# EAGLE design lm5175_smps_v0001 (EAGLE 6.4)
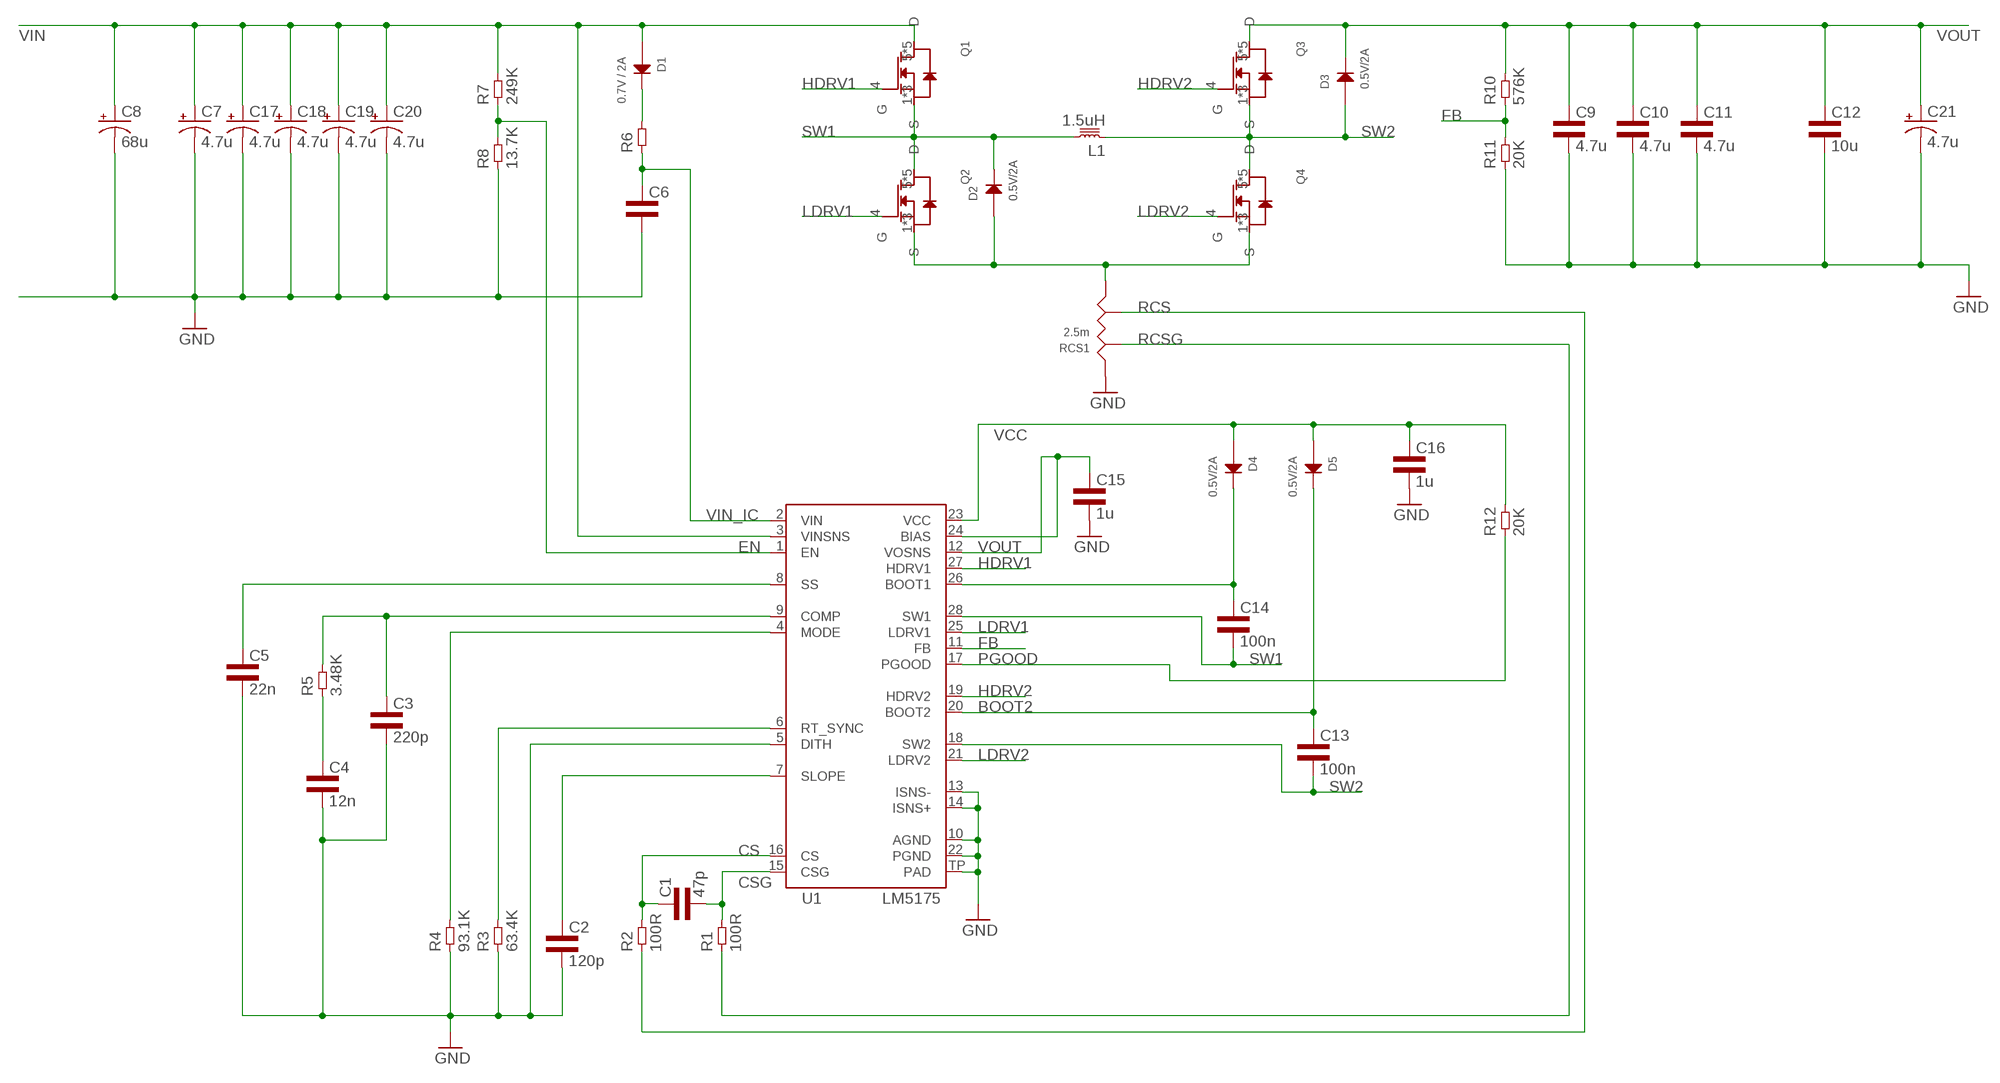
[diagram p0: schematic, sheet 1]

## Parts
C1  47p  CAP0402L3  [0402L3]
C2  120p  CAP0603L3  [0603L3]
C3  220p  CAP0603L3  [0603L3]
C4  12n  CAP0603L3  [0603L3]
C5  22n  CAP0603L3  [0603L3]
C6  CAP0603L3  [0603L3]
C7  4.7u  CPOL-USCT7343  [CT7343]
C8  68u  CPOL-US153CLV-0810  [153CLV-0810]
C9  4.7u  CAP1206L3  [1206L3]
C10  4.7u  CAP1206L3  [1206L3]
C11  4.7u  CAP1206L3  [1206L3]
C12  10u  CAP1206L3  [1206L3]
C13  100n  CAP0603L3  [0603L3]
C14  100n  CAP0603L3  [0603L3]
C15  1u  CAP0603L3  [0603L3]
C16  1u  CAP0603L3  [0603L3]
C17  4.7u  CPOL-USCT7343  [CT7343]
C18  4.7u  CPOL-USCT7343  [CT7343]
C19  4.7u  CPOL-USCT7343  [CT7343]
C20  4.7u  CPOL-USCT7343  [CT7343]
C21  4.7u  CPOL-USSANYO_SMD_E12  [SANYO-OSCON_SMD_E12]
D1  0.7V / 2A  DIODESMA  [SMA-2]
D2  0.5V/2A  DIODESMA  [SMA-2]
D3  0.5V/2A  DIODESMA  [SMA-2]
D4  0.5V/2A  DIODESMA  [SMA-2]
D5  0.5V/2A  DIODESMA  [SMA-2]
L1  1.5uH  INDUCTOR5752  [5.7X5.2]
Q1  CSD18540Q5B  [Q5B]
Q2  CSD18540Q5B  [Q5B]
Q3  CSD18540Q5B  [Q5B]
Q4  CSD18540Q5B  [Q5B]
R1  100R  RES0603L3  [0603L3]
R2  100R  RES0603L3  [0603L3]
R3  63.4K  RES0603L3  [0603L3]
R4  93.1K  RES0603L3  [0603L3]
R5  3.48K  RES0603L3  [0603L3]
R6  RES0603L3  [0603L3]
R7  249K  RES0603L3  [0603L3]
R8  13.7K  RES0603L3  [0603L3]
R10  576K  RES0603L3  [0603L3]
R11  20K  RES0603L3  [0603L3]
R12  20K  RES0603L3  [0603L3]
RCS1  2.5m  CSRES  [R2512]
U1  LM5175  [R-PDSO-G28]

## Nets
BOOT2: C13.P$1 D5.2(CATHODE) U1.20(BOOT2)
CS: C1.P$1 R2.P$2 U1.16(CS)
CSG: C1.P$2 R1.P$2 U1.15(CSG)
EN: R7.P$1 R8.P$2 U1.1(EN)
FB: R10.P$1 R11.P$2 U1.11(FB)
GND: C2.P$2 C3.P$2 C4.P$2 C5.P$2 C6.P$2 C7.- C8.- C9.2 C10.2 C11.2 C12.2 C15.P$2 C16.P$2 C17.- C18.- C19.- C20.- C21.- R3.P$1 R4.P$1 R8.P$1 R11.P$1 RCS1.1_1 RCS1.1_2 U1.5(DITH) U1.10(AGND) U1.13(ISNS-) U1.14(ISNS+) U1.22(PGND) U1.TP(PAD)
HDRV1: Q1.4(G) U1.27(HDRV1)
HDRV2: Q3.4(G) U1.19(HDRV2)
LDRV1: Q2.4(G) U1.25(LDRV1)
LDRV2: Q4.4(G) U1.21(LDRV2)
N$3: C2.P$1 U1.7(SLOPE)
N$5: R3.P$2 U1.6(RT_SYNC)
N$6: R4.P$2 U1.4(MODE)
N$7: C4.P$1 R5.P$1
N$8: C3.P$1 R5.P$2 U1.9(COMP)
N$11: C5.P$1 U1.8(SS)
N$12: D1.2(CATHODE) R6.P$2
N$20: C14.P$1 D4.2(CATHODE) U1.26(BOOT1)
PGOOD: R12.P$1 U1.17(PGOOD)
RCS: R2.P$1 RCS1.CS_2
RCSG: R1.P$1 RCS1.CS_1
SNS_HIGH: D2.1(ANODE) Q2.1(S) Q2.2(S) Q2.3(S) Q4.1(S) Q4.2(S) Q4.3(S) RCS1.2_1 RCS1.2_2
SW1: C14.P$2 D2.2(CATHODE) L1.2 Q1.1(S) Q1.2(S) Q1.3(S) Q2.5(D) Q2.6(D) Q2.7(D) Q2.8(D) Q2.9(D) U1.28(SW1)
SW2: C13.P$2 D3.1(ANODE) L1.1 Q3.1(S) Q3.2(S) Q3.3(S) Q4.5(D) Q4.6(D) Q4.7(D) Q4.8(D) Q4.9(D) U1.18(SW2)
VCC: C16.P$1 D4.1(ANODE) D5.1(ANODE) R12.P$2 U1.23(VCC)
VIN: C7.+ C8.+ C17.+ C18.+ C19.+ C20.+ D1.1(ANODE) Q1.5(D) Q1.6(D) Q1.7(D) Q1.8(D) Q1.9(D) R7.P$2 U1.3(VINSNS)
VIN_IC: C6.P$1 R6.P$1 U1.2(VIN)
VOUT: C9.1 C10.1 C11.1 C12.1 C15.P$1 C21.+ D3.2(CATHODE) Q3.5(D) Q3.6(D) Q3.7(D) Q3.8(D) Q3.9(D) R10.P$2 U1.12(VOSNS) U1.24(BIAS)

## Library data of the parts
C1-C6 C9-C16 = common:CAP
C7 C8 C17-C21 = rcl:CPOL-US: POLARIZED CAPACITOR, American symbol
D1-D5 = common:DIODE
L1 = common:INDUCTOR
Q1-Q4 = common:CSD18540Q5B: N-Channel High-Power MosFET; I_MAX: 221A; PD: 195W; PULSED_DRAIN_CURRENT: 400A; VGS: +/- 20V; V_MAX: 60V
R1-R8 R10-R12 = common:RES
RCS1 = common:CSRES: Current sense resistor with optimized footprint for sense accuracy. Vias should be place at the outer edges of the sense pads with traces connecting them. This provides an error margin of .6% to 2% as long as all other layout guidelines are followed.
U1 = common:LM5175: The LM5175 is a synchronous four-switch buck-boost 1• Single Inductor Buck-Boost Controller for Step- Up/Step-Down DC/DC Conversion DC/DC controller capable of regulating the output voltage at, above, or below the input voltage.

## Board
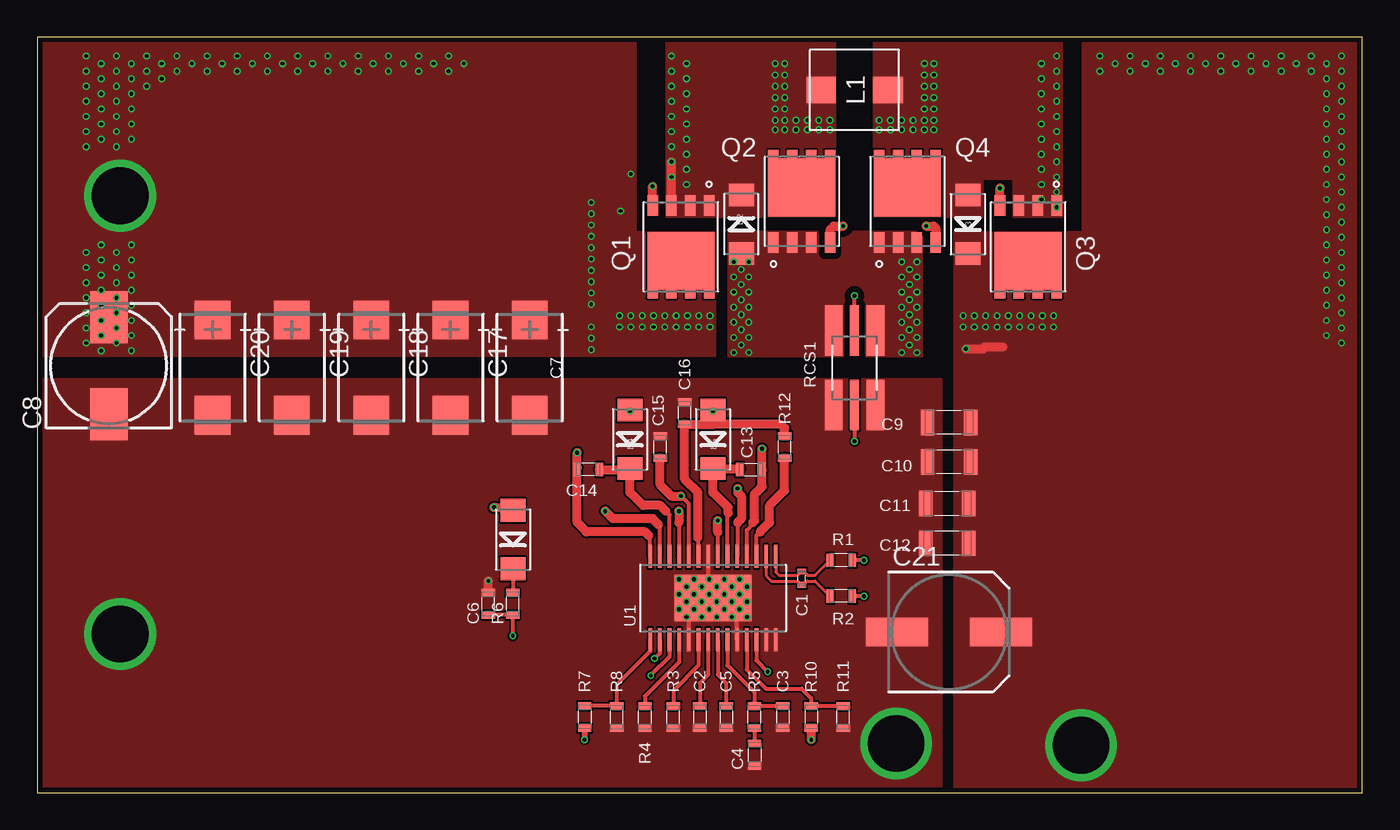
[diagram p1: board, top side]
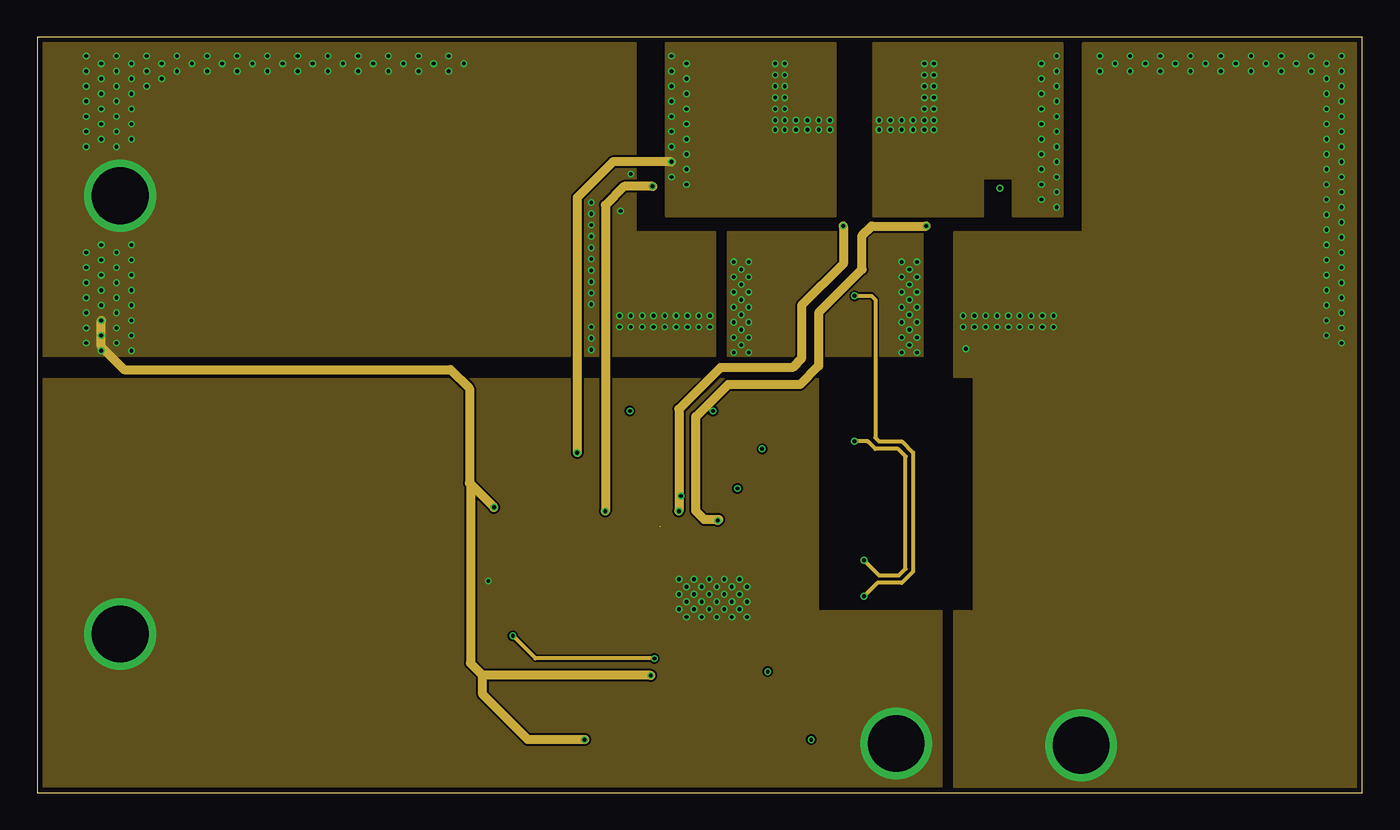
[diagram p2: board, inner layer Route2]
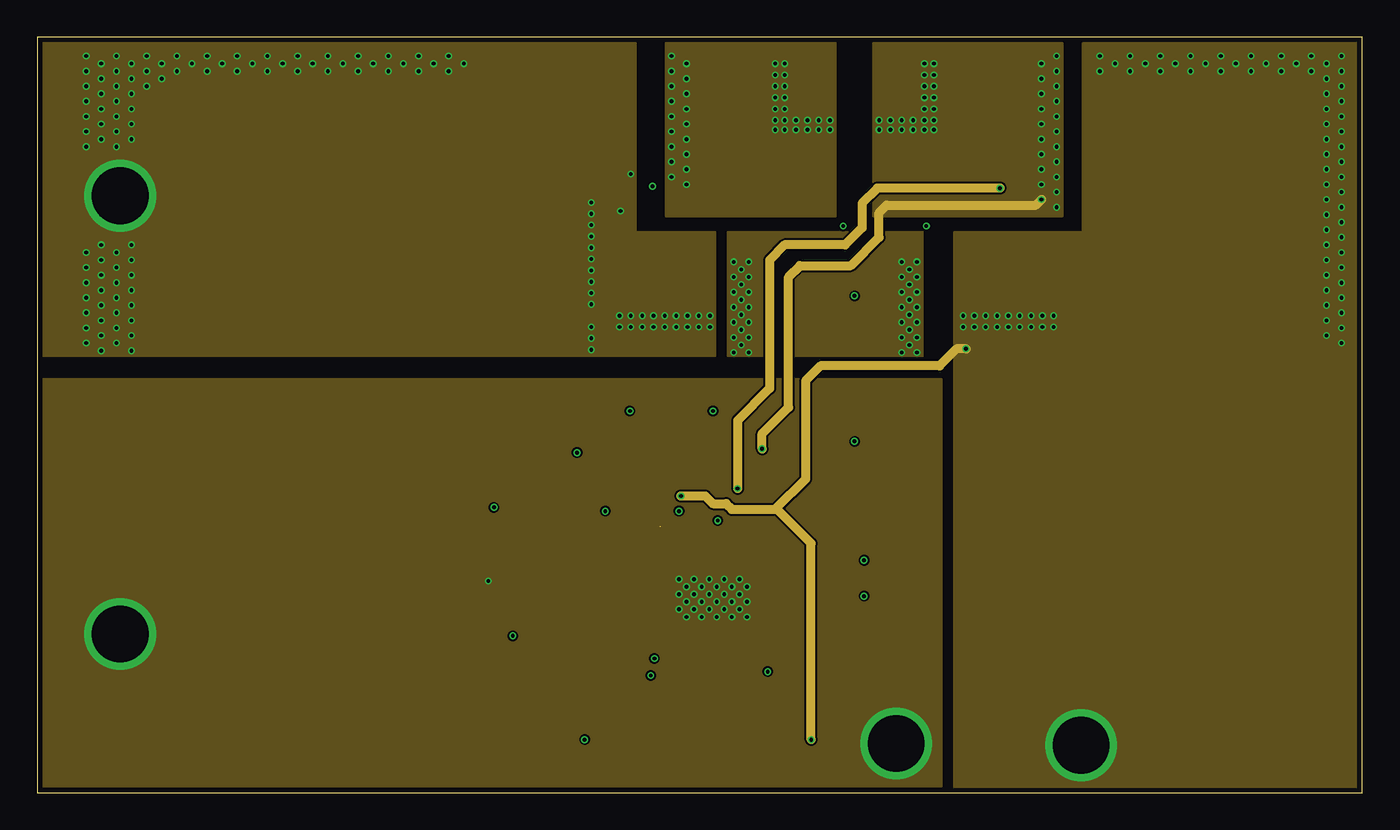
[diagram p3: board, inner layer Route3]
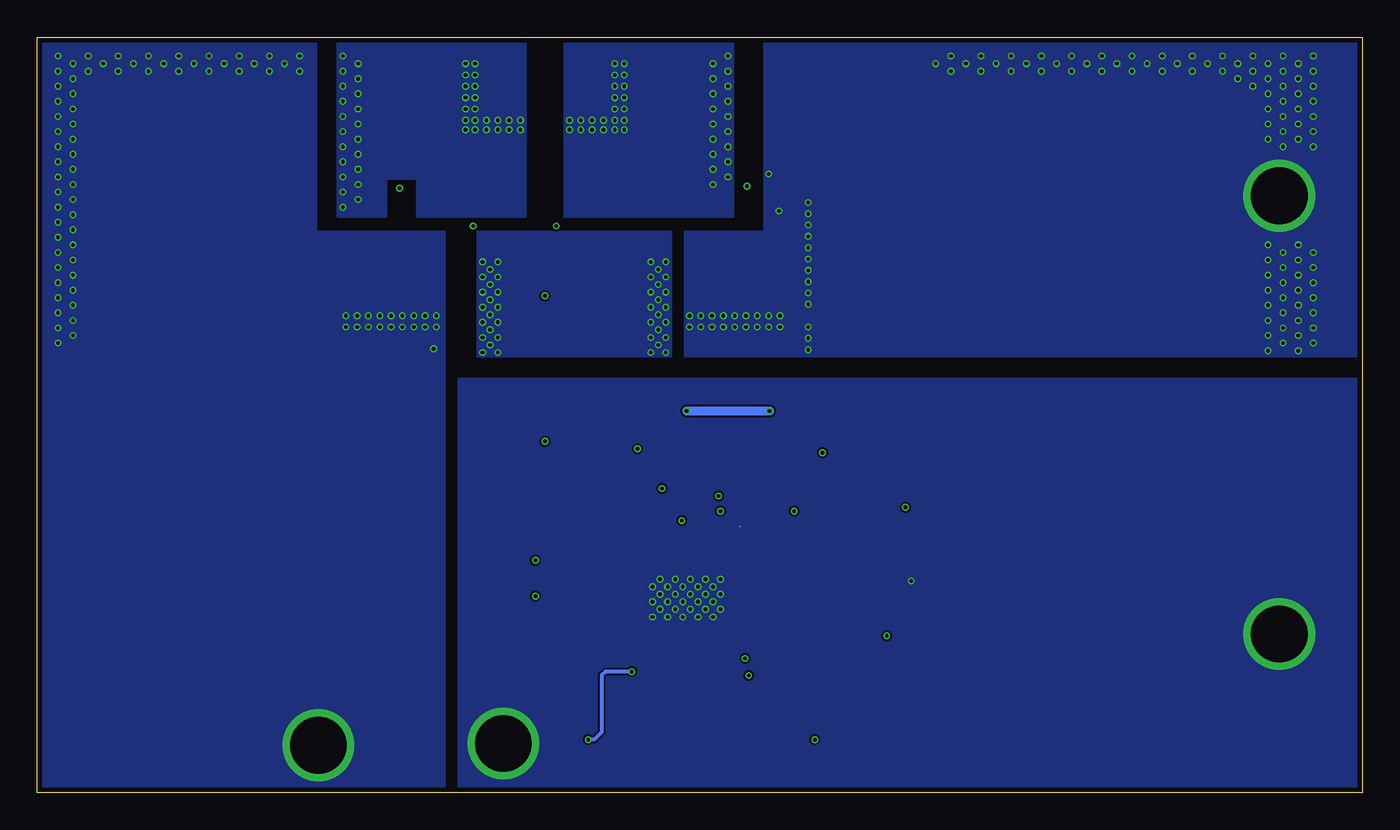
[diagram p4: board, bottom side, seen from below]

Size 89.15 x 50.8 mm. Coordinates in mm from the lower left corner, seen from the top.
Outline: 0,0 89.15,0 89.15,50.8 0,50.8 0,0
Copper layers (1*2*3*16): Top 0.035mm / dielectric 1.5mm / Route2 0.035mm / dielectric 0.15mm / Route3 0.035mm / dielectric 0.2mm / Bottom 0.035mm
Design rules "osh_4_layer": minimum track width 5mil, minimum drill 10mil, track to track 5mil, track to pad 5mil, pad to pad 5mil, via to via 5mil, smd to smd 5mil, copper to edge 13mil, drill to drill 5mil, minimum pad ring 4mil, minimum via ring 4mil, stop-mask expansion 4mil, vias tented up to drill 16mil, thermal gap 10mil

### Footprints (pad centres in the part's own frame; a part is rotated, then mirrored left to right if it is on the bottom)
0402L3 = smd 0.4 x 0.6: P$1 -0.45,0; P$2 0.45,0
0603L3 = smd 0.5 x 0.9: P$1 -0.75,0; P$2 0.75,0
CT7343 = smd 2.6 x 2.4: + -3.2,0; - 3.2,0
153CLV-0810 = smd 3.5 x 2.5: + 3.25,0; - -3.25,0
1206L3 = smd 0.9 x 1.7: 1 -1.45,0; 2 1.45,0
SANYO-OSCON_SMD_E12 = smd 4.15 x 1.9: + 3.5,0; - -3.5,0
SMA-2 = smd 1.52 x 1.68: 1 -1.965,0; 2 1.965,0
5.7X5.2 = smd 2 x 1.8: 1 -2.25,0; 2 2.25,0
Q5B = smd 1.372 x 0.71: 1 2.77,-1.905; 2 2.77,-0.635; 3 2.77,0.635; 4 2.77,1.905 | smd 0.59 x 0.71: 5 -3.161,1.905; 6 -3.161,0.635; 7 -3.161,-0.635; 8 -3.161,-1.905 | smd 3.85 x 4.52: 9 -0.941,0
R2512 = smd 3.4 x 1.2: 1_1 -2.5,-1.4; 1_2 -2.5,1.4; 2_1 2.5,-1.4; 2_2 2.5,1.4 | smd 3.4 x 0.6: CS_1 -2.5,0; CS_2 2.5,0
R-PDSO-G28 = smd 0.25 x 1.55: 1 -4.225,-2.8; 2 -3.575,-2.8; 3 -2.925,-2.8; 4 -2.275,-2.8; 5 -1.625,-2.8; 6 -0.975,-2.8; 7 -0.325,-2.8; 8 0.325,-2.8; 9 0.975,-2.8; 10 1.625,-2.8; 11 2.275,-2.8; 12 2.925,-2.8; 13 3.575,-2.8; 14 4.225,-2.8; 15 4.225,2.8; 16 3.575,2.8; 17 2.925,2.8; 18 2.275,2.8; 19 1.625,2.8; 20 0.975,2.8; 21 0.325,2.8; 22 -0.325,2.8; 23 -0.975,2.8; 24 -1.625,2.8; 25 -2.275,2.8; 26 -2.925,2.8; 27 -3.575,2.8; 28 -4.225,2.8 | smd 5.18 x 3.1: TP 0,0

### Placement (x,y rotation side)
C1  51.44,14.41 90 top
C2  44.58,5.08 270 top
C3  50.16,5.08 270 top
C4  48.26,2.54 270 top
C5  46.36,5.08 270 top
C6  30.35,12.7 90 top
C7  33.15,28.57 270 top
C8  4.83,28.7 90 top
C9  61.34,24.89 180 top
C10  61.34,22.23 180 top
C11  61.21,19.43 180 top
C12  61.21,16.76 180 top
C13  48.01,21.72 0 top
C14  37.08,21.72 180 top
C15  41.91,23.24 90 top
C16  43.56,25.53 90 top
C17  27.81,28.57 270 top
C18  22.48,28.57 270 top
C19  17.14,28.57 270 top
C20  11.81,28.57 270 top
C21  61.34,10.79 0 top
D1  32,17.02 270 top
D2  47.37,38.23 90 top
D3  62.61,38.23 270 top
D4  39.88,23.75 270 top
D5  45.47,23.75 270 top
L1  54.99,47.24 180 top
Q1  43.31,36.7 90 top
Q2  51.44,39.75 270 top
Q3  66.67,36.7 90 top
Q4  58.55,39.75 270 top
R1  54.1,15.62 180 top
R2  54.1,13.21 180 top
R3  42.8,5.08 90 top
R4  40.89,5.08 90 top
R5  48.26,5.08 90 top
R6  32,12.7 90 top
R7  36.83,5.08 270 top
R8  38.99,5.08 90 top
R10  52.07,5.08 270 top
R11  54.23,5.08 90 top
R12  50.29,23.24 90 top
RCS1  54.99,28.57 90 top
U1  45.47,13.08 0 top

### Tracks (layer width: path | path; a pad name or v marks a point on that pad's centre or on a via)
BOOT2
  Top 0.254: U1.20 46.44,18.75 46.48,18.8
  Top 0.61: 46.48,18.8 46.48,19.18 45.47,20.19 D5.2 47.26,21.78 C13.P$1
CS
  Top 0.203: U1.16 49.04,14.59 49.4,14.22 51.17,14.22 C1.P$1 51.56,13.96 51.82,14.22 52.34,14.22 R2.P$2
CSG
  Top 0.203: U1.15 49.69,14.82 49.91,14.61 51.17,14.61 C1.P$2 51.56,14.86 51.82,14.61 52.34,14.61 R1.P$2
EN
  Top 0.254: U1.1 41.24,9.49 38.99,7.24 R8.P$2 R7.P$1
FB
  Top 0.254: U1.11 47.74,8.27 49.02,6.99 51.44,6.99 52.07,6.35 R10.P$1 R11.P$2
GND  (via drill 0.25, 3.81)
  Top 0.254: U1.22 45.14,14.42 v45.21,14.35 | U1.5 43.84,11.66 v43.69,11.81 | U1.10 47.09,11.79 47.12,11.81 v46.74,11.81
  Top 0.61: C6.P$2 v30.35,14.22
  other vias: 43.18,14.35 44.2,14.35 46.23,14.35 47.24,14.35 43.18,13.34 43.18,12.32 44.7,11.81 45.72,11.81 47.75,13.84 43.69,13.84 44.7,13.84 45.72,13.84 46.74,13.84 43.69,12.83 44.2,12.32 44.2,13.34 44.7,12.83 45.21,12.32 45.21,13.34 45.72,12.83 46.23,12.32 46.23,13.34 46.74,12.83 47.24,13.34 47.24,12.32 47.75,12.83 47.75,11.81 5.59,10.67 57.79,3.3
  pour Bottom: 0.38,27.81 60.83,27.81 60.83,0.38 0.38,0.38
  pour Route2 (rank 6): 0.38,27.81 60.83,27.81 60.83,0.38 0.38,0.38
  pour Route3: 0.38,27.81 60.83,27.81 60.83,0.38 0.38,0.38
  pour Top (no thermals): 48.9,9.53 48.9,11.56 46.99,11.56 46.99,13.08 49.78,13.08 49.78,9.53
  pour Top (rank 6, no thermals): 0.38,27.81 60.83,27.81 60.83,0.38 0.38,0.38
HDRV1  (via drill 0.25)  (1 unrouted)
  Top 0.254: U1.27 41.89,17.89 | 41.91,17.91 41.78,18.03
  Top 0.61: Q1.4 v41.4,40.77 | v38.23,18.92 38.73,18.41 41.4,18.41 41.78,18.03
  Route2 0.61: v41.4,40.77 39.5,40.77 38.23,39.5 v38.23,18.92
HDRV2  (via drill 0.25)
  Top 0.254: 47.12,18.16 47.12,15.91 U1.19
  Top 0.61: Q3.4 v64.77,40.64 | v47.12,20.45 47.12,20.19 47.37,19.94 47.37,18.41 47.12,18.16
  Route3 0.61: v64.77,40.64 56.52,40.64 55.5,39.62 55.5,37.97 54.36,36.83 50.29,36.83 49.28,35.81 49.28,27.18 47.12,25.02 v47.12,20.45
LDRV1  (via drill 0.25)
  Top 0.254: 43.18,18.16 43.18,15.89 U1.25
  Top 0.61: Q2.4 53.34,37.85 53.59,38.1 v54.23,38.1 | v43.18,18.92 43.18,18.16
  Route2 0.61: v54.23,38.1 54.23,35.56 51.44,32.77 51.44,29.21 50.8,28.57 45.97,28.57 43.18,25.78 v43.18,18.92
LDRV2  (via drill 0.25)
  Top 0.254: U1.21 45.79,17.52 45.78,17.53
  Top 0.61: 45.78,17.53 v45.78,18.29 | v59.82,38.1 60.33,38.1 60.45,37.97 Q4.4
  Route2 0.61: v59.82,38.1 56.13,38.1 55.5,37.47 55.5,35.18 52.58,32.26 52.58,28.7 51.31,27.43 46.48,27.43 44.32,25.27 44.32,18.92 44.89,18.35 45.85,18.35 v45.78,18.29
N$1
  cutout Route2: 52.7,27.81 62.87,27.81 62.87,12.32 52.7,12.32
N$3
  Top 0.254: U1.7 45.14,7.93 44.58,7.37 C2.P$1
N$5
  Top 0.254: U1.6 44.49,8.55 42.8,6.86 R3.P$2
N$6
  Top 0.254: U1.4 43.19,8.77 40.89,6.48 R4.P$2
N$7
  Top 0.254: R5.P$1 C4.P$1
N$8
  Top 0.254: U1.9 46.44,8.55 48.26,6.73 R5.P$2 C3.P$1
N$11
  Top 0.254: U1.8 45.79,7.93 46.36,7.37 C5.P$1
N$12
  Top 0.254: D1.2 R6.P$2
N$20
  Top 0.254: U1.26 42.55,18.67 42.29,18.92
  Top 0.61: 37.85,21.7 C14.P$1 39.88,21.72 D4.2 39.88,20.19 40.77,19.3 41.91,19.3 42.29,18.92
PGOOD
  Top 0.254: U1.17 48.39,17.28 48.64,17.53
  Top 0.61: 48.64,17.53 49.28,18.16 49.28,19.3 50.29,20.32 R12.P$1
RCS  (via drill 0.25)
  Top 0.254: RCS1.CS_2 v54.99,33.4 | v55.63,13.21 R2.P$1
  Route2 0.254: v54.99,33.4 56.13,33.4 56.39,33.15 56.39,23.88 56.64,23.62 58.17,23.62 58.93,22.86 58.93,14.86 58.17,14.1 56.52,14.1 v55.63,13.21
RCSG  (via drill 0.25)
  Top 0.254: RCS1.CS_1 v54.99,23.62 | v55.63,15.62 R1.P$1
  Route2 0.254: v55.63,15.62 56.64,14.61 57.98,14.61 58.42,15.05 58.42,22.61 57.91,23.11 56.39,23.11 55.88,23.62 v54.99,23.62
SNS_HIGH  (via drill 0.25)
  other vias: 46.86,29.59 46.86,30.61 46.86,31.62 46.86,32.64 46.86,33.66 46.86,34.67 46.86,35.69 47.37,35.18 47.37,34.16 47.37,33.15 47.37,32.13 47.37,31.11 47.37,30.1 47.88,35.69 47.88,34.67 47.88,33.66 47.88,32.64 47.88,31.62 47.88,30.61 47.88,29.59 59.18,35.69 59.18,34.67 59.18,33.66 59.18,32.64 59.18,31.62 59.18,30.61 59.18,29.59 58.67,30.1 58.67,31.11 58.67,32.13 58.67,33.15 58.67,34.16 58.67,35.18 58.17,35.69 58.17,34.67 58.17,33.66 58.17,32.64 58.17,31.62 58.17,30.61 58.17,29.59
  pour Top (isolate 0.406, no thermals): 46.48,37.72 46.48,29.34 59.56,29.34 59.56,37.72
  pour Bottom: 46.48,37.72 59.56,37.72 59.56,29.34 46.48,29.34
  pour Route3: 46.48,37.72 59.56,37.72 59.56,29.34 46.48,29.34
  pour Route2 (rank 6): 46.48,37.72 59.56,37.72 59.56,29.34 46.48,29.34
SW1  (via drill 0.25)
  Top 0.254: U1.28 41.24,17.18 41.15,17.27 | C14.P$2 36.33,21.83 36.32,21.84
  Top 0.61: Q1.3 v42.67,42.42 | 41.15,17.27 40.89,17.53 36.96,17.53 36.32,18.16 36.32,21.84 v36.32,22.86
  Route2 0.61: v42.67,42.42 38.73,42.42 36.32,40.01 v36.32,22.86
  other vias: 42.67,49.53 42.67,48.51 42.67,47.5 42.67,46.48 42.67,45.47 42.67,44.45 42.67,43.43 42.67,41.4 43.69,40.89 43.69,41.91 43.69,42.93 43.69,43.94 43.69,44.96 43.69,45.97 43.69,46.99 43.69,48.01 43.69,49.02 50.29,49.02 50.29,48.26 50.29,47.5 50.29,46.74 50.29,45.97 50.29,45.21 51.05,45.21 51.82,45.21 52.58,45.21 53.34,45.21 49.66,49.02 49.66,48.26 49.66,47.5 49.66,46.74 49.66,45.97 49.66,45.21 49.66,44.58 50.29,44.58 51.05,44.58 51.82,44.58 52.58,44.58 53.34,44.58
  pour Top (no thermals): 42.29,38.73 53.72,38.73 53.72,50.42 42.29,50.42
  pour Route2 (rank 6): 42.29,50.42 53.72,50.42 53.72,38.73 42.29,38.73
  pour Route3: 42.29,50.42 53.72,50.42 53.72,38.73 42.29,38.73
  pour Bottom: 42.29,50.42 53.72,50.42 53.72,38.73 42.29,38.73
SW2  (via drill 0.25)
  Top 0.254: U1.18 47.74,17.64 48.13,18.03 48.13,18.16
  Top 0.61: v48.77,23.11 v48.76,23.1 C13.P$2 48.77,21.7 48.77,20.57 48.26,20.07 48.26,18.29 48.13,18.16
  Route3 0.61: v48.77,23.11 48.77,24.13 50.55,25.91 50.55,34.67 51.31,35.43 54.74,35.43 56.64,37.34 56.64,38.99 57.15,39.5 67.18,39.5 v67.56,39.88
  other vias: 68.58,49.53 68.58,48.51 67.56,49.02 67.56,48.01 68.58,47.5 67.56,46.99 68.58,46.48 67.56,45.97 68.58,45.47 67.56,44.96 68.58,44.45 67.56,43.94 68.58,43.43 67.56,42.93 68.58,42.42 67.56,41.91 68.58,41.4 67.56,40.89 68.58,40.39 68.58,39.37 56.64,45.21 57.4,45.21 58.17,45.21 58.93,45.21 59.69,45.21 59.69,45.97 59.69,46.74 59.69,47.5 59.69,48.26 59.69,49.02 60.33,49.02 60.33,48.26 60.33,47.5 60.33,46.74 60.33,45.97 60.33,45.21 56.64,44.58 57.4,44.58 58.17,44.58 58.93,44.58 59.69,44.58 60.33,44.58
  pour Top (no thermals): 56.26,38.73 63.63,38.73 63.63,41.27 65.66,41.27 65.66,38.73 68.96,38.73 68.96,50.42 56.26,50.42
  pour Route2 (rank 6): 56.26,50.42 68.96,50.42 68.96,38.73 65.66,38.73 65.66,41.27 63.63,41.27 63.63,38.73 56.26,38.73
  pour Route3: 68.96,38.73 56.26,38.73 56.26,50.42 68.96,50.42
  pour Bottom: 56.26,50.42 68.96,50.42 68.96,38.73 65.66,38.73 65.66,41.27 63.63,41.27 63.63,38.73 56.26,38.73
VCC  (via drill 0.25)
  Top 0.254: U1.23 44.49,17.1 44.45,17.14
  Top 0.61: 44.45,17.14 44.45,20.19 43.56,21.08 C16.P$1 45.45,24.78 | D4.1 v39.88,25.65 | v45.47,25.65 D5.1 45.45,24.78 | R12.P$2 50.29,24.51 50.04,24.77 45.47,24.77 45.45,24.78
  Bottom 0.61: v39.88,25.65 v45.47,25.65
VIN  (via drill 0.25, 3.81)
  Top 0.254: U1.3 42.54,9.14 v41.28,7.87
  Top 0.406: R7.P$2 v36.83,3.56
  Top 0.61: D1.1 v30.73,19.18
  Route2 0.61: v4.32,31.75 4.32,29.97 5.84,28.45 27.81,28.45 29.08,27.18 29.08,20.83 29.15,20.77 | 29.15,20.77 v30.73,19.18 | v41.28,7.87 29.97,7.87 | v36.83,3.56 33.02,3.56 29.97,6.6 29.97,7.87 | 29.15,20.77 29.15,8.7 29.97,7.87
  other vias: 3.3,30.23 4.32,30.73 3.3,31.24 3.3,32.26 4.32,32.77 3.3,33.27 4.32,33.78 3.3,34.29 3.3,35.31 3.3,36.32 3.3,43.43 3.3,44.45 3.3,45.47 3.3,46.48 3.3,47.5 3.3,48.51 3.3,49.53 4.32,49.02 4.32,48.01 4.32,46.99 4.32,45.97 4.32,44.96 4.32,43.94 4.32,39.88 4.32,38.86 4.32,36.83 4.32,35.81 4.32,34.8 39.24,39.12 39.94,41.59 37.27,39.69 37.27,29.78 5.59,40.13 5.33,49.53 5.33,48.51 6.35,49.02 7.37,49.53 7.37,48.51 8.38,49.02 9.4,49.53 9.4,48.51 10.41,49.02 11.43,49.53 11.43,48.51 12.45,49.02 13.46,49.53 13.46,48.51 14.48,49.02 15.49,49.53 15.49,48.51 16.51,49.02 17.53,49.53 17.53,48.51 18.54,49.02 19.56,49.53 19.56,48.51 20.57,49.02 21.59,49.53 21.59,48.51 22.61,49.02 23.62,49.53 23.62,48.51 24.64,49.02 25.65,48.51 25.65,49.53 26.67,49.02 27.69,48.51 27.69,49.53 28.7,49.02 37.27,38.93 37.27,38.16 37.27,37.4 37.27,36.64 37.27,35.88 37.27,35.12 37.27,34.35 37.27,33.59 37.27,32.83 45.28,32.07 37.27,31.31 37.27,30.54 44.51,32.07 43.75,32.07 42.99,32.07 42.23,32.07 41.47,32.07 40.7,32.07 39.94,32.07 39.18,32.07 39.18,31.31 39.94,31.31 40.7,31.31 41.47,31.31 42.23,31.31 42.99,31.31 43.75,31.31 44.51,31.31 45.28,31.31 6.35,29.72 7.37,47.5 5.33,47.5 5.33,46.48 4.32,29.72 8.38,48.01 6.35,48.01 6.35,46.99 5.33,45.47 5.33,44.45 5.33,43.43 5.33,36.32 5.33,35.31 5.33,34.29 5.33,33.27 5.33,32.26 5.33,31.24 5.33,30.23 6.35,45.97 6.35,44.96 6.35,43.94 6.35,36.83 6.35,35.81 6.35,34.8 6.35,33.78 6.35,32.77 6.35,31.75 6.35,30.73
  pour Top (no thermals): 45.59,37.72 45.59,29.34 0.38,29.34 0.38,50.42 40.26,50.42 40.26,37.72
  pour Route2 (rank 6): 0.38,50.42 40.26,50.42 40.26,37.72 45.59,37.72 45.59,29.34 0.38,29.34
  pour Route3: 0.38,50.42 40.26,50.42 40.26,37.72 45.59,37.72 45.59,29.34 0.38,29.34
  pour Bottom: 0.38,50.42 40.26,50.42 40.26,37.72 45.59,37.72 45.59,29.34 0.38,29.34
VIN_IC  (via drill 0.25)
  Top 0.254: U1.2 41.89,9.38 v41.53,9.02 | C6.P$1 R6.P$1 v32,10.54
  Route2 0.254: v41.53,9.02 33.53,9.02 v32,10.54
VOUT  (via drill 0.25, 3.81)
  Top 0.254: U1.24 43.84,19.41 v43.31,19.94 | U1.12 48.39,8.89 v49.15,8.13
  Top 0.61: C15.P$1 41.91,20.7 42.67,19.94 v43.31,19.94 | R10.P$2 v52.07,3.56 | v62.48,29.84 63.63,29.84 63.75,29.97 64.97,29.97
  Route3 0.61: v62.48,29.84 61.85,29.84 60.71,28.7 52.7,28.7 51.69,27.69 51.69,21.08 49.72,19.11 | 49.72,19.11 49.66,19.05 46.74,19.05 46.36,19.43 45.47,19.43 44.96,19.94 v43.31,19.94 | v52.07,3.56 52.07,16.76 49.72,19.11
  Bottom 0.254: v49.15,8.13 50.93,8.13 51.18,7.87 51.18,4.06 51.69,3.56 v52.07,3.56
  other vias: 87.76,38.35 87.76,39.37 87.76,40.39 87.76,41.4 87.76,42.42 87.76,43.43 87.76,44.45 87.76,45.47 87.76,46.48 87.76,47.5 87.76,48.51 86.74,48.01 86.74,46.99 86.74,45.97 86.74,44.96 86.74,43.94 86.74,42.93 86.74,41.91 86.74,40.89 86.74,39.88 86.74,38.86 87.76,49.53 86.74,49.02 87.76,37.34 87.76,36.32 87.76,35.31 87.76,34.29 87.76,33.27 87.76,32.26 87.76,31.24 87.76,30.23 86.74,37.85 86.74,36.83 86.74,35.81 86.74,34.8 86.74,33.78 86.74,32.77 86.74,31.75 86.74,30.73 70.23,3.17 85.72,49.53 85.72,48.51 84.71,49.02 83.69,48.51 83.69,49.53 82.68,49.02 81.66,48.51 81.66,49.53 80.65,49.02 79.63,49.53 79.63,48.51 78.61,49.02 77.6,49.53 77.6,48.51 76.58,49.02 75.56,49.53 75.56,48.51 74.55,49.02 73.53,48.51 73.53,49.53 72.52,49.02 71.5,48.51 71.5,49.53 62.29,32.07 63.06,32.07 63.82,32.07 64.58,32.07 65.34,32.07 66.1,32.07 66.87,32.07 67.63,32.07 68.39,32.07 62.29,31.31 63.06,31.31 63.82,31.31 64.58,31.31 65.34,31.31 66.1,31.31 66.87,31.31 67.63,31.31 68.39,31.31
  pour Top (no thermals): 61.72,0.25 61.72,37.72 70.36,37.72 70.36,50.42 88.77,50.42 88.77,0.25
  pour Route2 (rank 6): 70.36,50.42 88.77,50.42 88.77,0.25 61.72,0.25 61.72,37.72 70.36,37.72
  pour Route3: 70.36,50.42 88.77,50.42 88.77,0.25 61.72,0.25 61.72,37.72 70.36,37.72
  pour Bottom: 70.36,50.42 88.77,50.42 88.77,0.25 61.72,0.25 61.72,37.72 70.36,37.72